# Altium project Glucometer-I.C.- Mis.PrjPcb
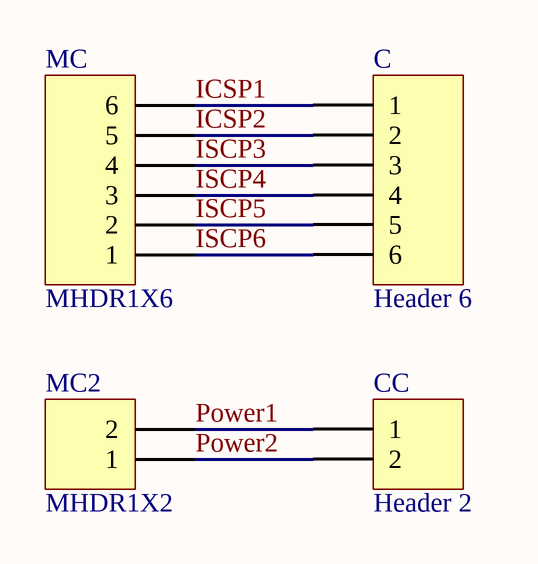
[diagram p0: Mis - ICSP conector.SchDoc]
5 sheets, 15 parts. Net scope: flat (ports and power ports of the same name join across sheets).
Board files: Glucometer-I.C.- Mis 2.PcbDoc, Mis - ICSP conector.PcbDoc, Glucometer-I.C.- Mis.PcbDoc, Glucometer-I.C.- Mis 1.PcbDoc, Mis - AFE LMP91000.PcbDoc
Sheets:
  Mis - ICSP conector.SchDoc
  Glucometer-I.C.- Mis.SchDoc
  Glucometer-I.C.- Mis 1.SchDoc
  Mis - AFE LMP91000.SchDoc
  Glucometer-I.C.- Mis 2.SchDoc

## Sheet Mis - ICSP conector.SchDoc
size Letter

### Parts
C  Header 6  [HDR1X6]
CC  Header 2  [HDR1X2]
MC  MHDR1X6  [MHDR1X6]
MC2  MHDR1X2  [MHDR1X2]

### Nets
ICSP1: C.1 MC.6
ICSP2: C.2 MC.5
ISCP3: C.3 MC.4
ISCP4: C.4 MC.3
ISCP5: C.5 MC.2
ISCP6: C.6 MC.1
Power1: CC.1 MC2.2
Power2: CC.2 MC2.1

### Library data of the parts
C = Header 6: Header, 6-Pin; LatestRevisionDate: 17-Jul-2002; LatestRevisionNote: Re-released for DXP Platform.; Publisher: Altium Limited
CC = Header 2: Header, 2-Pin; LatestRevisionDate: 17-Jul-2002; LatestRevisionNote: Re-released for DXP Platform.; Publisher: Altium Limited
MC = MHDR1X6: Header, 6-Pin; LatestRevisionDate: 17-Jul-2002; LatestRevisionNote: Re-released for DXP Platform.; Publisher: Altium Limited
MC2 = MHDR1X2: Header, 2-Pin; LatestRevisionDate: 17-Jul-2002; LatestRevisionNote: Re-released for DXP Platform.; Publisher: Altium Limited

## Sheet Glucometer-I.C.- Mis.SchDoc
size A4; PageSetup: Record=PageOptions|CenterHorizontal=True|CenterVertical=True|PrintScale=1.00|XCorrection=1.00|YCorrection=1.00|PrintKind=1|BorderSize=5000000|LeftOffset=0|BottomOffset=0|Orientation=1|PaperLength=1000|PaperWidth=1000|Scale=100|PaperSource=7|PrintQuality=-4|MediaType=1|DitherType=10|PaperKind=A4|PrintScaleMode=1
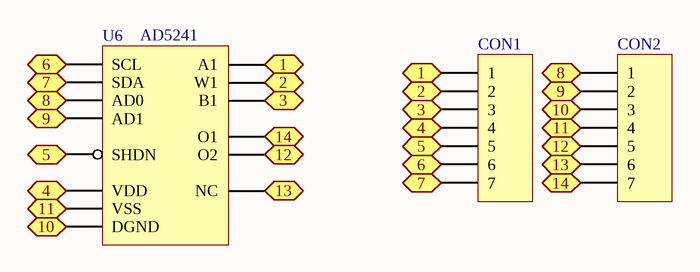
[diagram p1: Glucometer-I.C.- Mis.SchDoc]

### Parts
CON1  Header 7  [HDR1X7]  (value not drawn)
CON2  Header 7  [HDR1X7]  (value not drawn)
U6  AD5241  [R-14_N]

### Ports
1, 2, 3, 4, 5, 6, 7, 8, 9, 10, 11, 12, 13, 14

### Nets
M1: CON1.1 U6.1(A1) ; port 1
M2: CON1.2 U6.2(W1) ; port 2
M3: CON1.3 U6.3(B1) ; port 3
M4: CON1.4 U6.4(VDD) ; port 4
M5: CON1.5 U6.5(SHDN) ; port 5
M6: CON1.6 U6.6(SCL) ; port 6
M7: CON1.7 U6.7(SDA) ; port 7
M8: CON2.1 U6.8(AD0) ; port 8
M9: CON2.2 U6.9(AD1) ; port 9
M10: CON2.3 U6.10(DGND) ; port 10
M11: CON2.4 U6.11(VSS) ; port 11
M12: CON2.5 U6.12(O2) ; port 12
M13: CON2.6 U6.13(NC) ; port 13
M14: CON2.7 U6.14(O1) ; port 14

### Library data of the parts
CON1 CON2 = Header 7: Header, 7-Pin; LatestRevisionDate: 17-Jul-2002; LatestRevisionNote: Re-released for DXP Platform.; Publisher: Altium Limited
U6 = AD5241: AD5241BR

## Sheet Glucometer-I.C.- Mis 1.SchDoc
size Letter
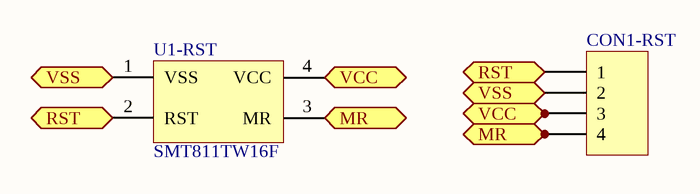
[diagram p2: Glucometer-I.C.- Mis 1.SchDoc]

### Parts
CON1-RST  Header 4  [HDR1X4]  (value not drawn)
U1-RST  SMT811TW16F  [SOT143]

### Ports
MR, RST, VCC, VSS

### Nets
NetCON1-RST_1: CON1-RST.1 U1-RST.2(RST) ; port RST
NetCON1-RST_2: CON1-RST.2 U1-RST.1(VSS) ; port VSS
NetCON1-RST_3: CON1-RST.3 U1-RST.4(VCC) ; port VCC
NetCON1-RST_4: CON1-RST.4 U1-RST.3(MR) ; port MR

### Library data of the parts
CON1-RST = Header 4: Header, 4-Pin; LatestRevisionDate: 17-Jul-2002; LatestRevisionNote: Re-released for DXP Platform.; Publisher: Altium Limited
U1-RST = SMT811TW16F: Reset Circuit, 3.08V, Push Pull Inverted RST

## Sheet Mis - AFE LMP91000.SchDoc
size Letter
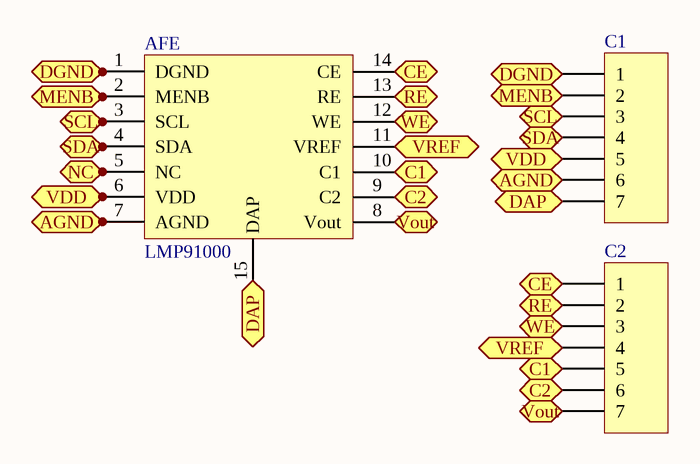
[diagram p3: Mis - AFE LMP91000.SchDoc]

### Parts
AFE  LMP91000  [WSON14]
C1  Header 7  [HDR1X7]  (value not drawn)
C2  Header 7  [HDR1X7]  (value not drawn)

### Ports
AGND, C1, C2, CE, DAP, DGND, MENB, NC, RE, SCL, SDA, VDD, Vout, VREF, WE

### Nets
NetAFE_1: AFE.1(DGND) C1.1 ; port DGND
NetAFE_2: AFE.2(MENB) C1.2 ; port MENB
NetAFE_3: AFE.3(SCL) C1.3 ; port SCL
NetAFE_4: AFE.4(SDA) C1.4 ; port SDA
NetAFE_5: AFE.5(NC) ; port NC
NetAFE_6: AFE.6(VDD) C1.5 ; port VDD
NetAFE_7: AFE.7(AGND) C1.6 ; port AGND
NetAFE_8: AFE.8(Vout) C2.7 ; port Vout
NetAFE_9: AFE.9(C2) C2.6 ; port C2
NetAFE_10: AFE.10(C1) C2.5 ; port C1
NetAFE_11: AFE.11(VREF) C2.4 ; port VREF
NetAFE_12: AFE.12(WE) C2.3 ; port WE
NetAFE_13: AFE.13(RE) C2.2 ; port RE
NetAFE_14: AFE.14(CE) C2.1 ; port CE
NetAFE_15: AFE.15(DAP) C1.7 ; port DAP

### Library data of the parts
C1 C2 = Header 7: Header, 7-Pin; LatestRevisionDate: 17-Jul-2002; LatestRevisionNote: Re-released for DXP Platform.; Publisher: Altium Limited

## Sheet Glucometer-I.C.- Mis 2.SchDoc
size Letter
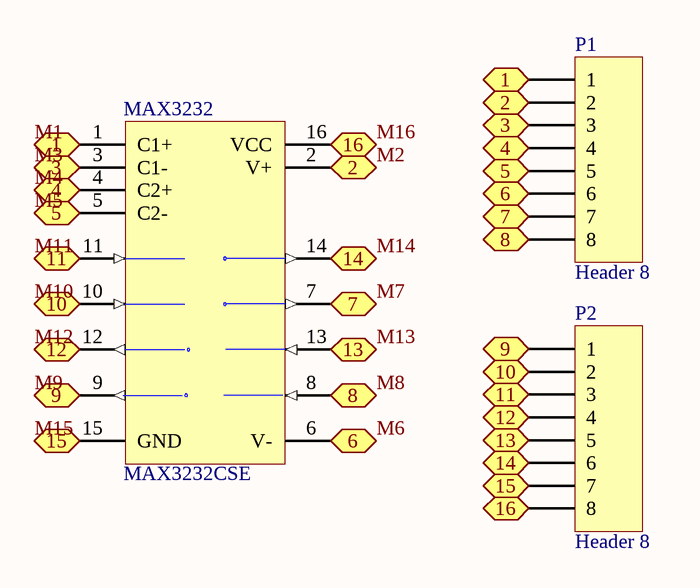
[diagram p4: Glucometer-I.C.- Mis 2.SchDoc]

### Parts
MAX3232  MAX3232CSE  [NSO16_N]
P1  Header 8  [HDR1X8]
P2  Header 8  [HDR1X8]

### Ports
1, 2, 3, 4, 5, 6, 7, 8, 9, 10, 11, 12, 13, 14, 15, 16

### Nets
M1: MAX3232.1(C1+) P1.1 ; port 1
M2: MAX3232.2(V+) P1.2 ; port 2
M3: MAX3232.3(C1-) P1.3 ; port 3
M4: MAX3232.4(C2+) P1.4 ; port 4
M5: MAX3232.5(C2-) P1.5 ; port 5
M6: MAX3232.6(V-) P1.6 ; port 6
M7: MAX3232.7(T2OUT) P1.7 ; port 7
M8: MAX3232.8(R2IN) P1.8 ; port 8
M9: MAX3232.9(R2OUT) P2.1 ; port 9
M10: MAX3232.10(T2IN) P2.2 ; port 10
M11: MAX3232.11(T1IN) P2.3 ; port 11
M12: MAX3232.12(R1OUT) P2.4 ; port 12
M13: MAX3232.13(R1IN) P2.5 ; port 13
M14: MAX3232.14(T1OUT) P2.6 ; port 14
M15: MAX3232.15(GND) P2.7 ; port 15
M16: MAX3232.16(VCC) P2.8 ; port 16

### Library data of the parts
MAX3232 = MAX3232CSE: 3.0V TO 5.5V, Low-Power, up to 1Mbps, True RS-232 Transceiver Using Four 0.1µF External Capacitor; Published: 16-Jan-2001; LatestRevisionDate: 13-Apr-2006; LatestRevisionNote: IPC-7351 Footprint Added.; DatasheetVersion: Mar-1999; PackageReference: NSO16; Publisher: Altium Limited; PackageDescription: 16-Pin Small Outline Integrated Circuit 1.27 mm Pitch; Code_JEDEC: MS-012-AC; Code_IPC: SOIC127P600-16; ComponentLink1Description: Manufacturer Link; ComponentLink1URL: http://www.maxim-ic.com/; ComponentLink2Description: Datasheet; ComponentLink2URL: http://pdfserv.maxim-ic.com/en/ds/MAX3222-MAX3241.pdf
P1 P2 = Header 8: Header, 8-Pin; LatestRevisionDate: 17-Jul-2002; LatestRevisionNote: Re-released for DXP Platform.; Publisher: Altium Limited

## Nets that join several sheets
M1: Glucometer-I.C.- Mis (CON1.1 U6.1), Glucometer-I.C.- Mis 2 (MAX3232.1 P1.1)
M2: Glucometer-I.C.- Mis (CON1.2 U6.2), Glucometer-I.C.- Mis 2 (MAX3232.2 P1.2)
M3: Glucometer-I.C.- Mis (CON1.3 U6.3), Glucometer-I.C.- Mis 2 (MAX3232.3 P1.3)
M4: Glucometer-I.C.- Mis (CON1.4 U6.4), Glucometer-I.C.- Mis 2 (MAX3232.4 P1.4)
M5: Glucometer-I.C.- Mis (CON1.5 U6.5), Glucometer-I.C.- Mis 2 (MAX3232.5 P1.5)
M6: Glucometer-I.C.- Mis (CON1.6 U6.6), Glucometer-I.C.- Mis 2 (MAX3232.6 P1.6)
M7: Glucometer-I.C.- Mis (CON1.7 U6.7), Glucometer-I.C.- Mis 2 (MAX3232.7 P1.7)
M8: Glucometer-I.C.- Mis (CON2.1 U6.8), Glucometer-I.C.- Mis 2 (MAX3232.8 P1.8)
M9: Glucometer-I.C.- Mis (CON2.2 U6.9), Glucometer-I.C.- Mis 2 (MAX3232.9 P2.1)
M10: Glucometer-I.C.- Mis (CON2.3 U6.10), Glucometer-I.C.- Mis 2 (MAX3232.10 P2.2)
M11: Glucometer-I.C.- Mis (CON2.4 U6.11), Glucometer-I.C.- Mis 2 (MAX3232.11 P2.3)
M12: Glucometer-I.C.- Mis (CON2.5 U6.12), Glucometer-I.C.- Mis 2 (MAX3232.12 P2.4)
M13: Glucometer-I.C.- Mis (CON2.6 U6.13), Glucometer-I.C.- Mis 2 (MAX3232.13 P2.5)
M14: Glucometer-I.C.- Mis (CON2.7 U6.14), Glucometer-I.C.- Mis 2 (MAX3232.14 P2.6)